# EasyEDA schematic Bravo-M2-ALU-Registers.json

## Sheets
1 Bravo-M2-ALU: TITLE: Bravo V1.0-M2-ALU; REV: 1.0; Date: 2021-11-21; Sheet: 1/4; Drawn By: Kaveh Majidi (CONFIG IOI)
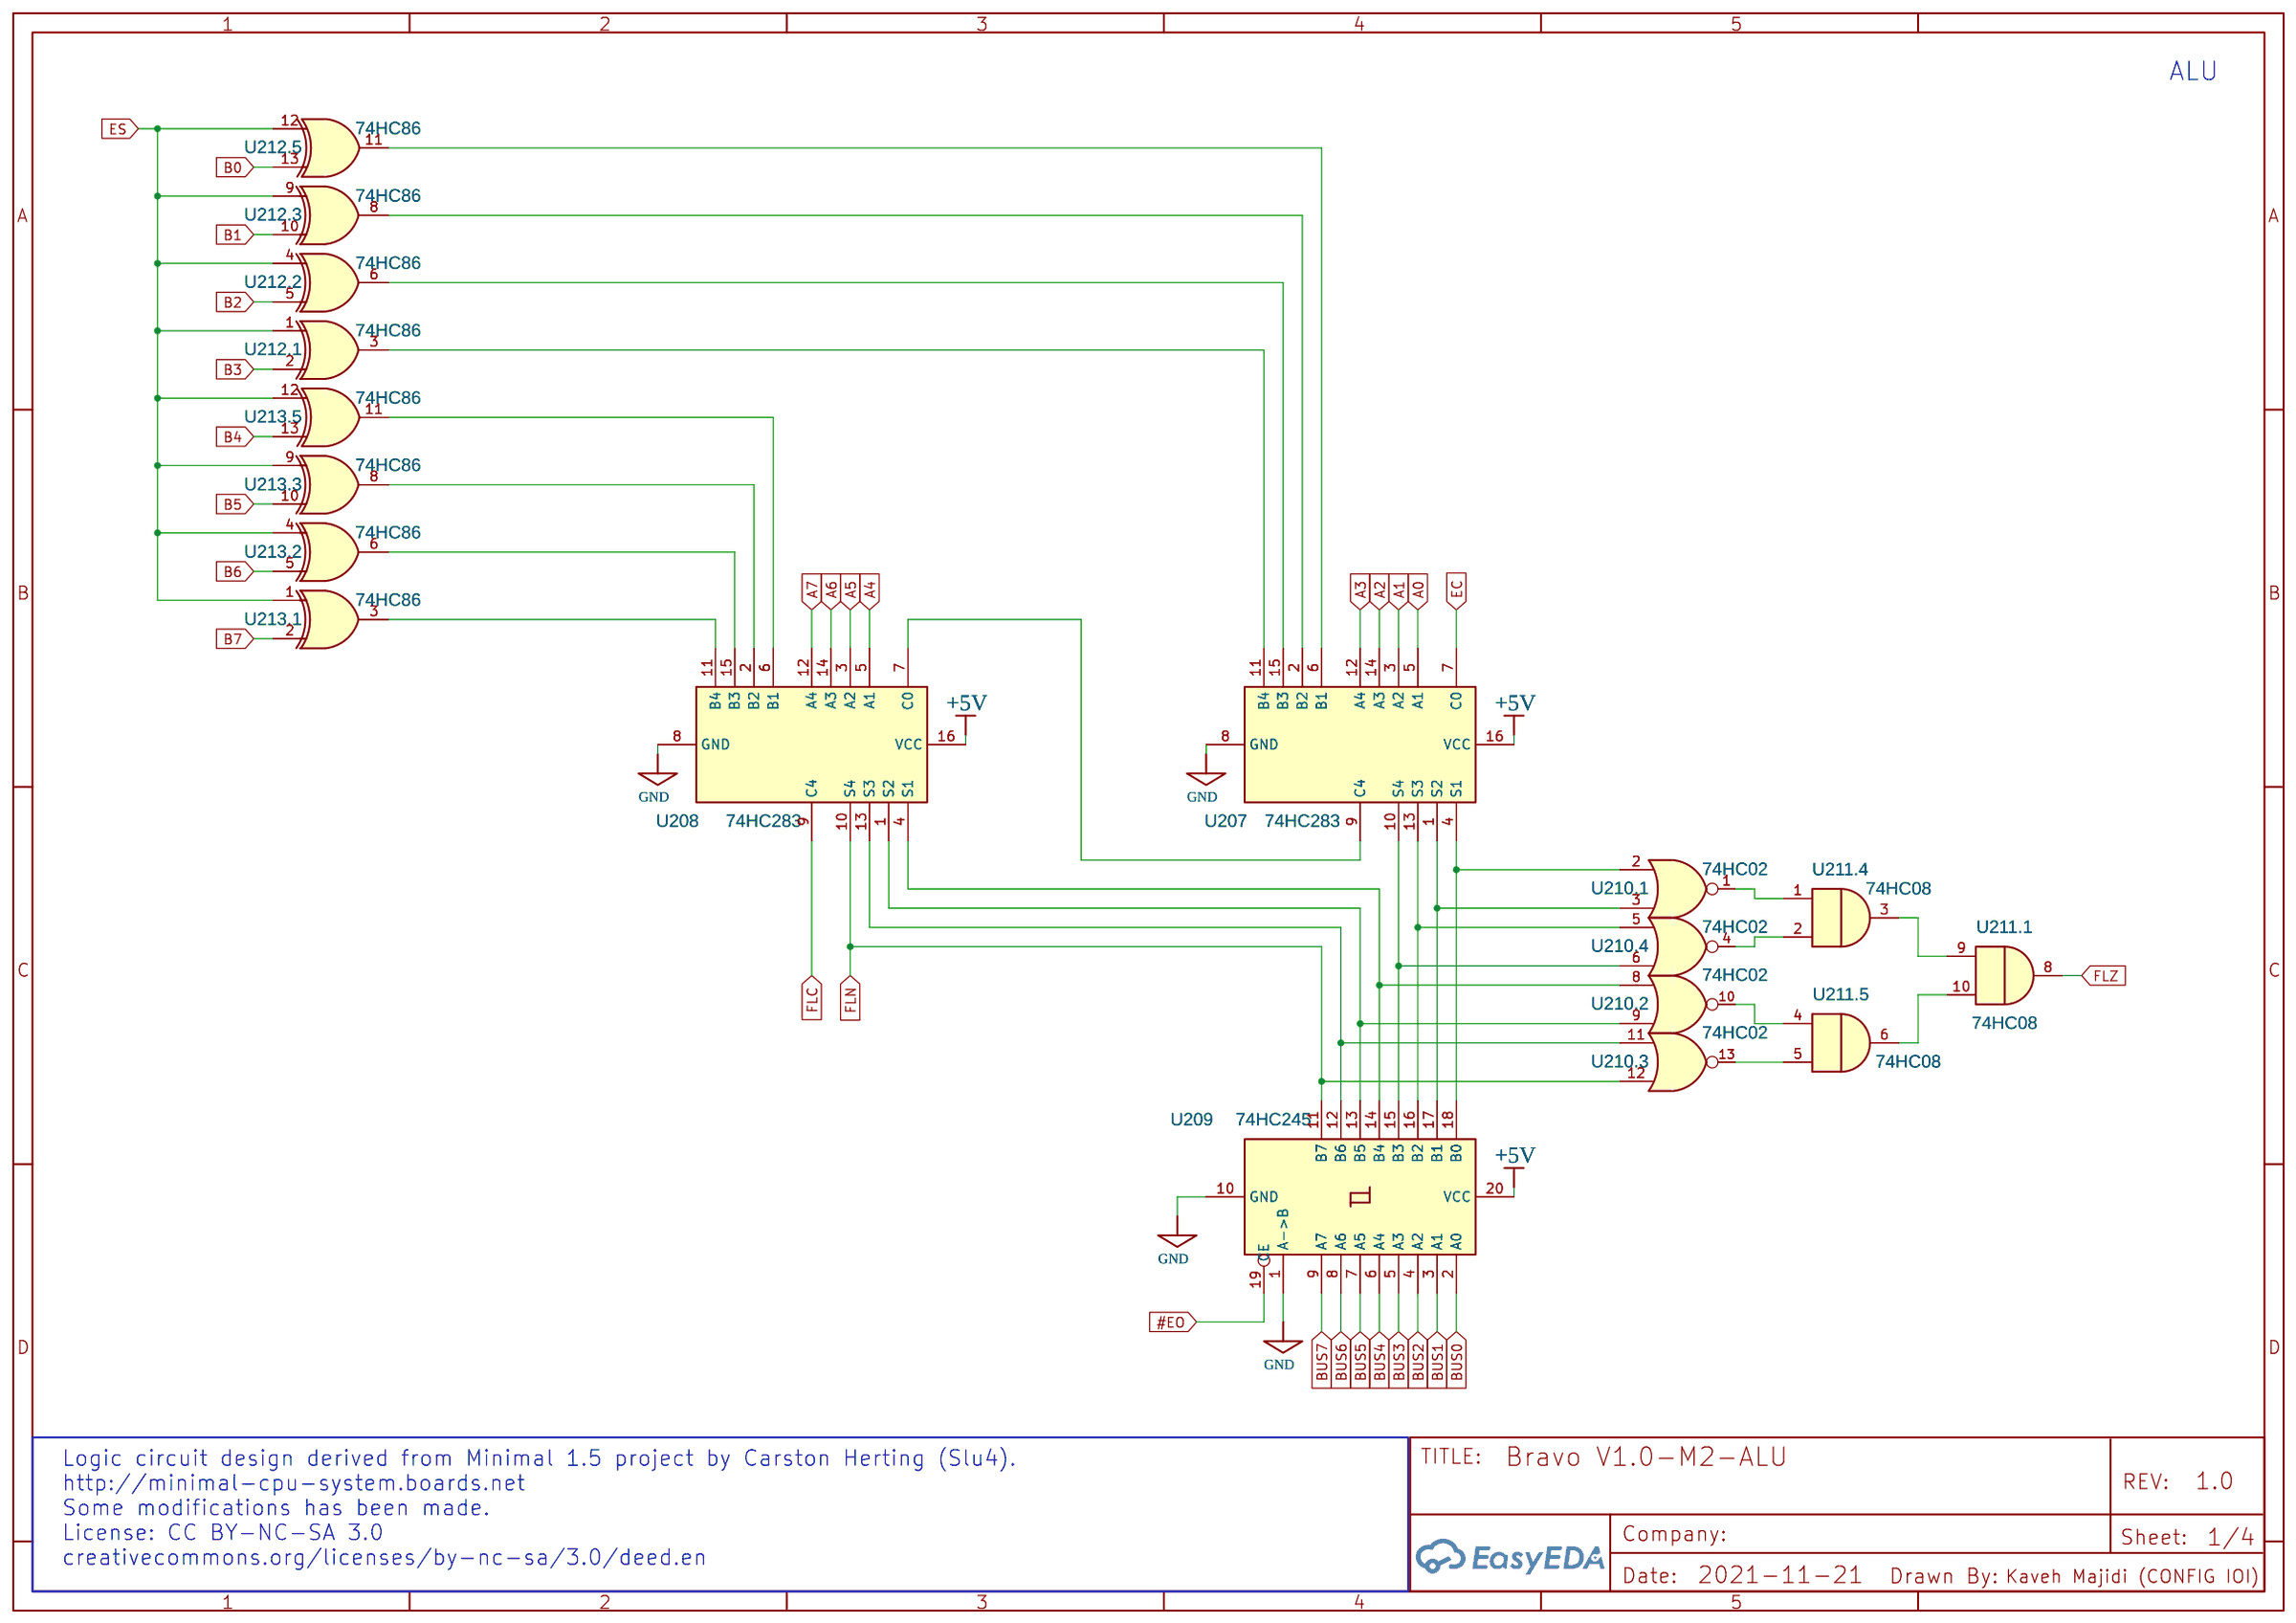
[diagram p0: Bravo-M2-ALU]
2 Bravo-M2-A Register: Sheet: 2/4
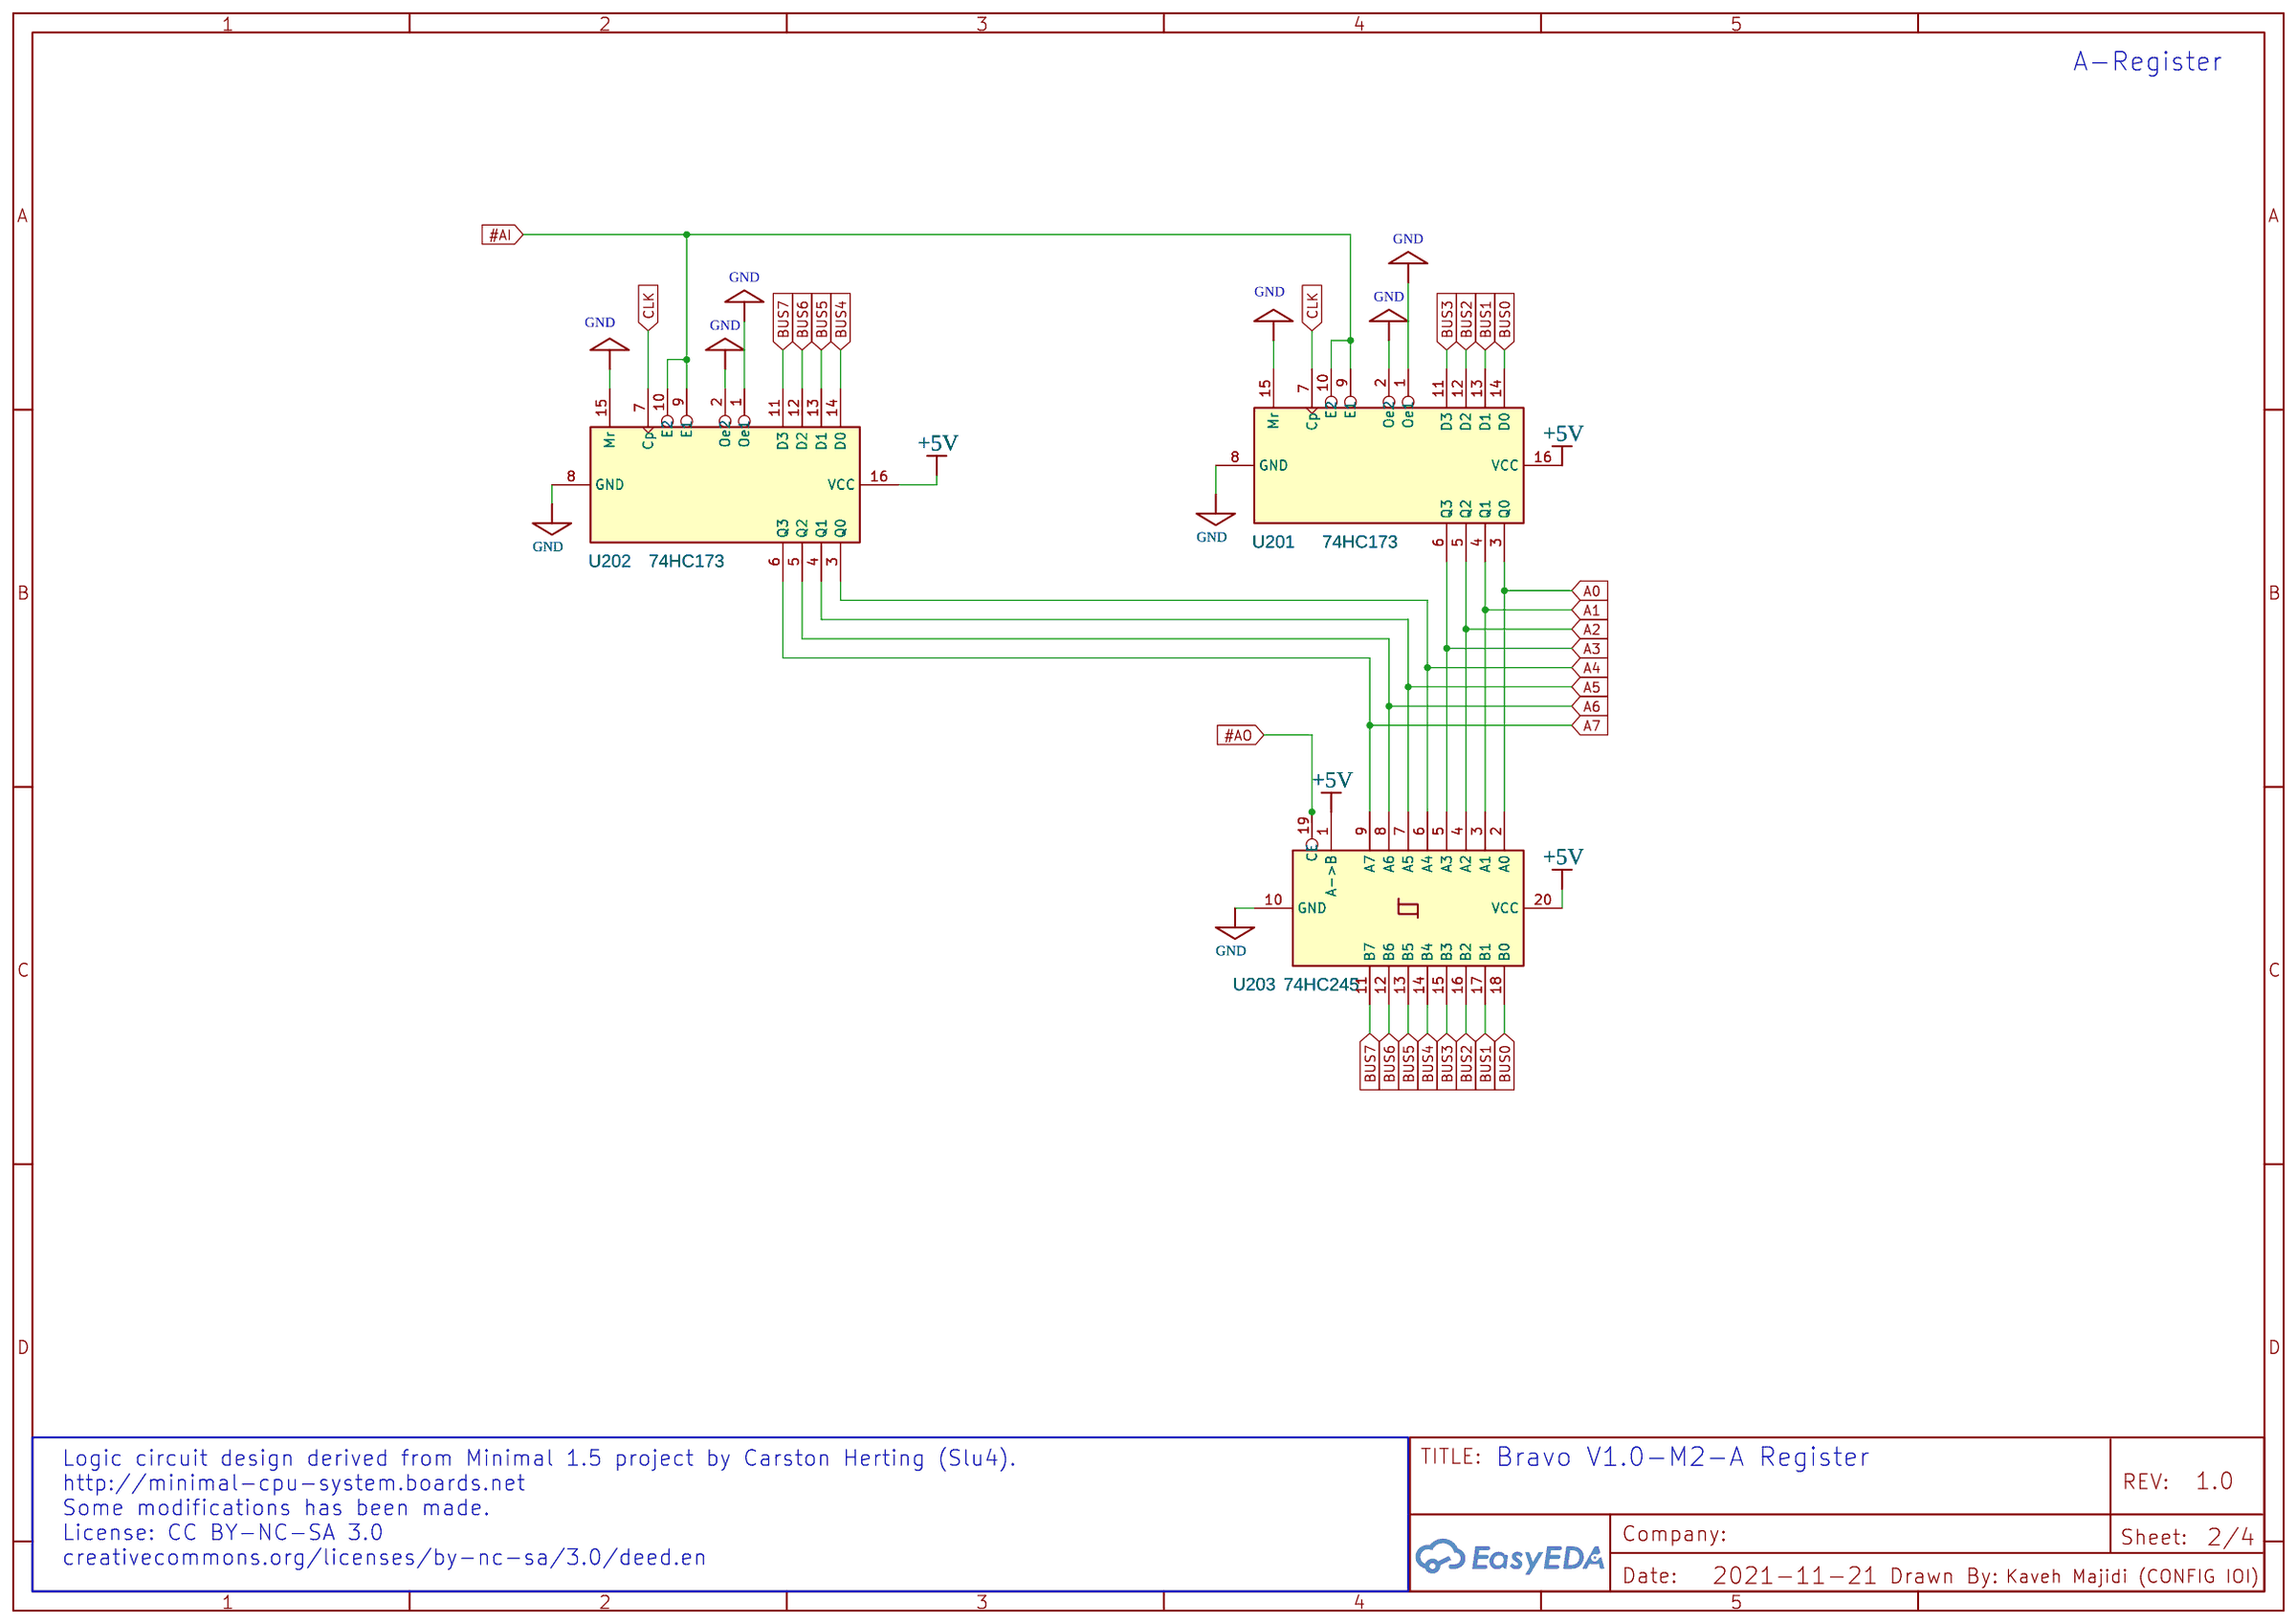
[diagram p1: Bravo-M2-A Register]
3 Bravo-M2-B Register: TITLE: Bravo V1.0-M2-B Register; Sheet: 3/4
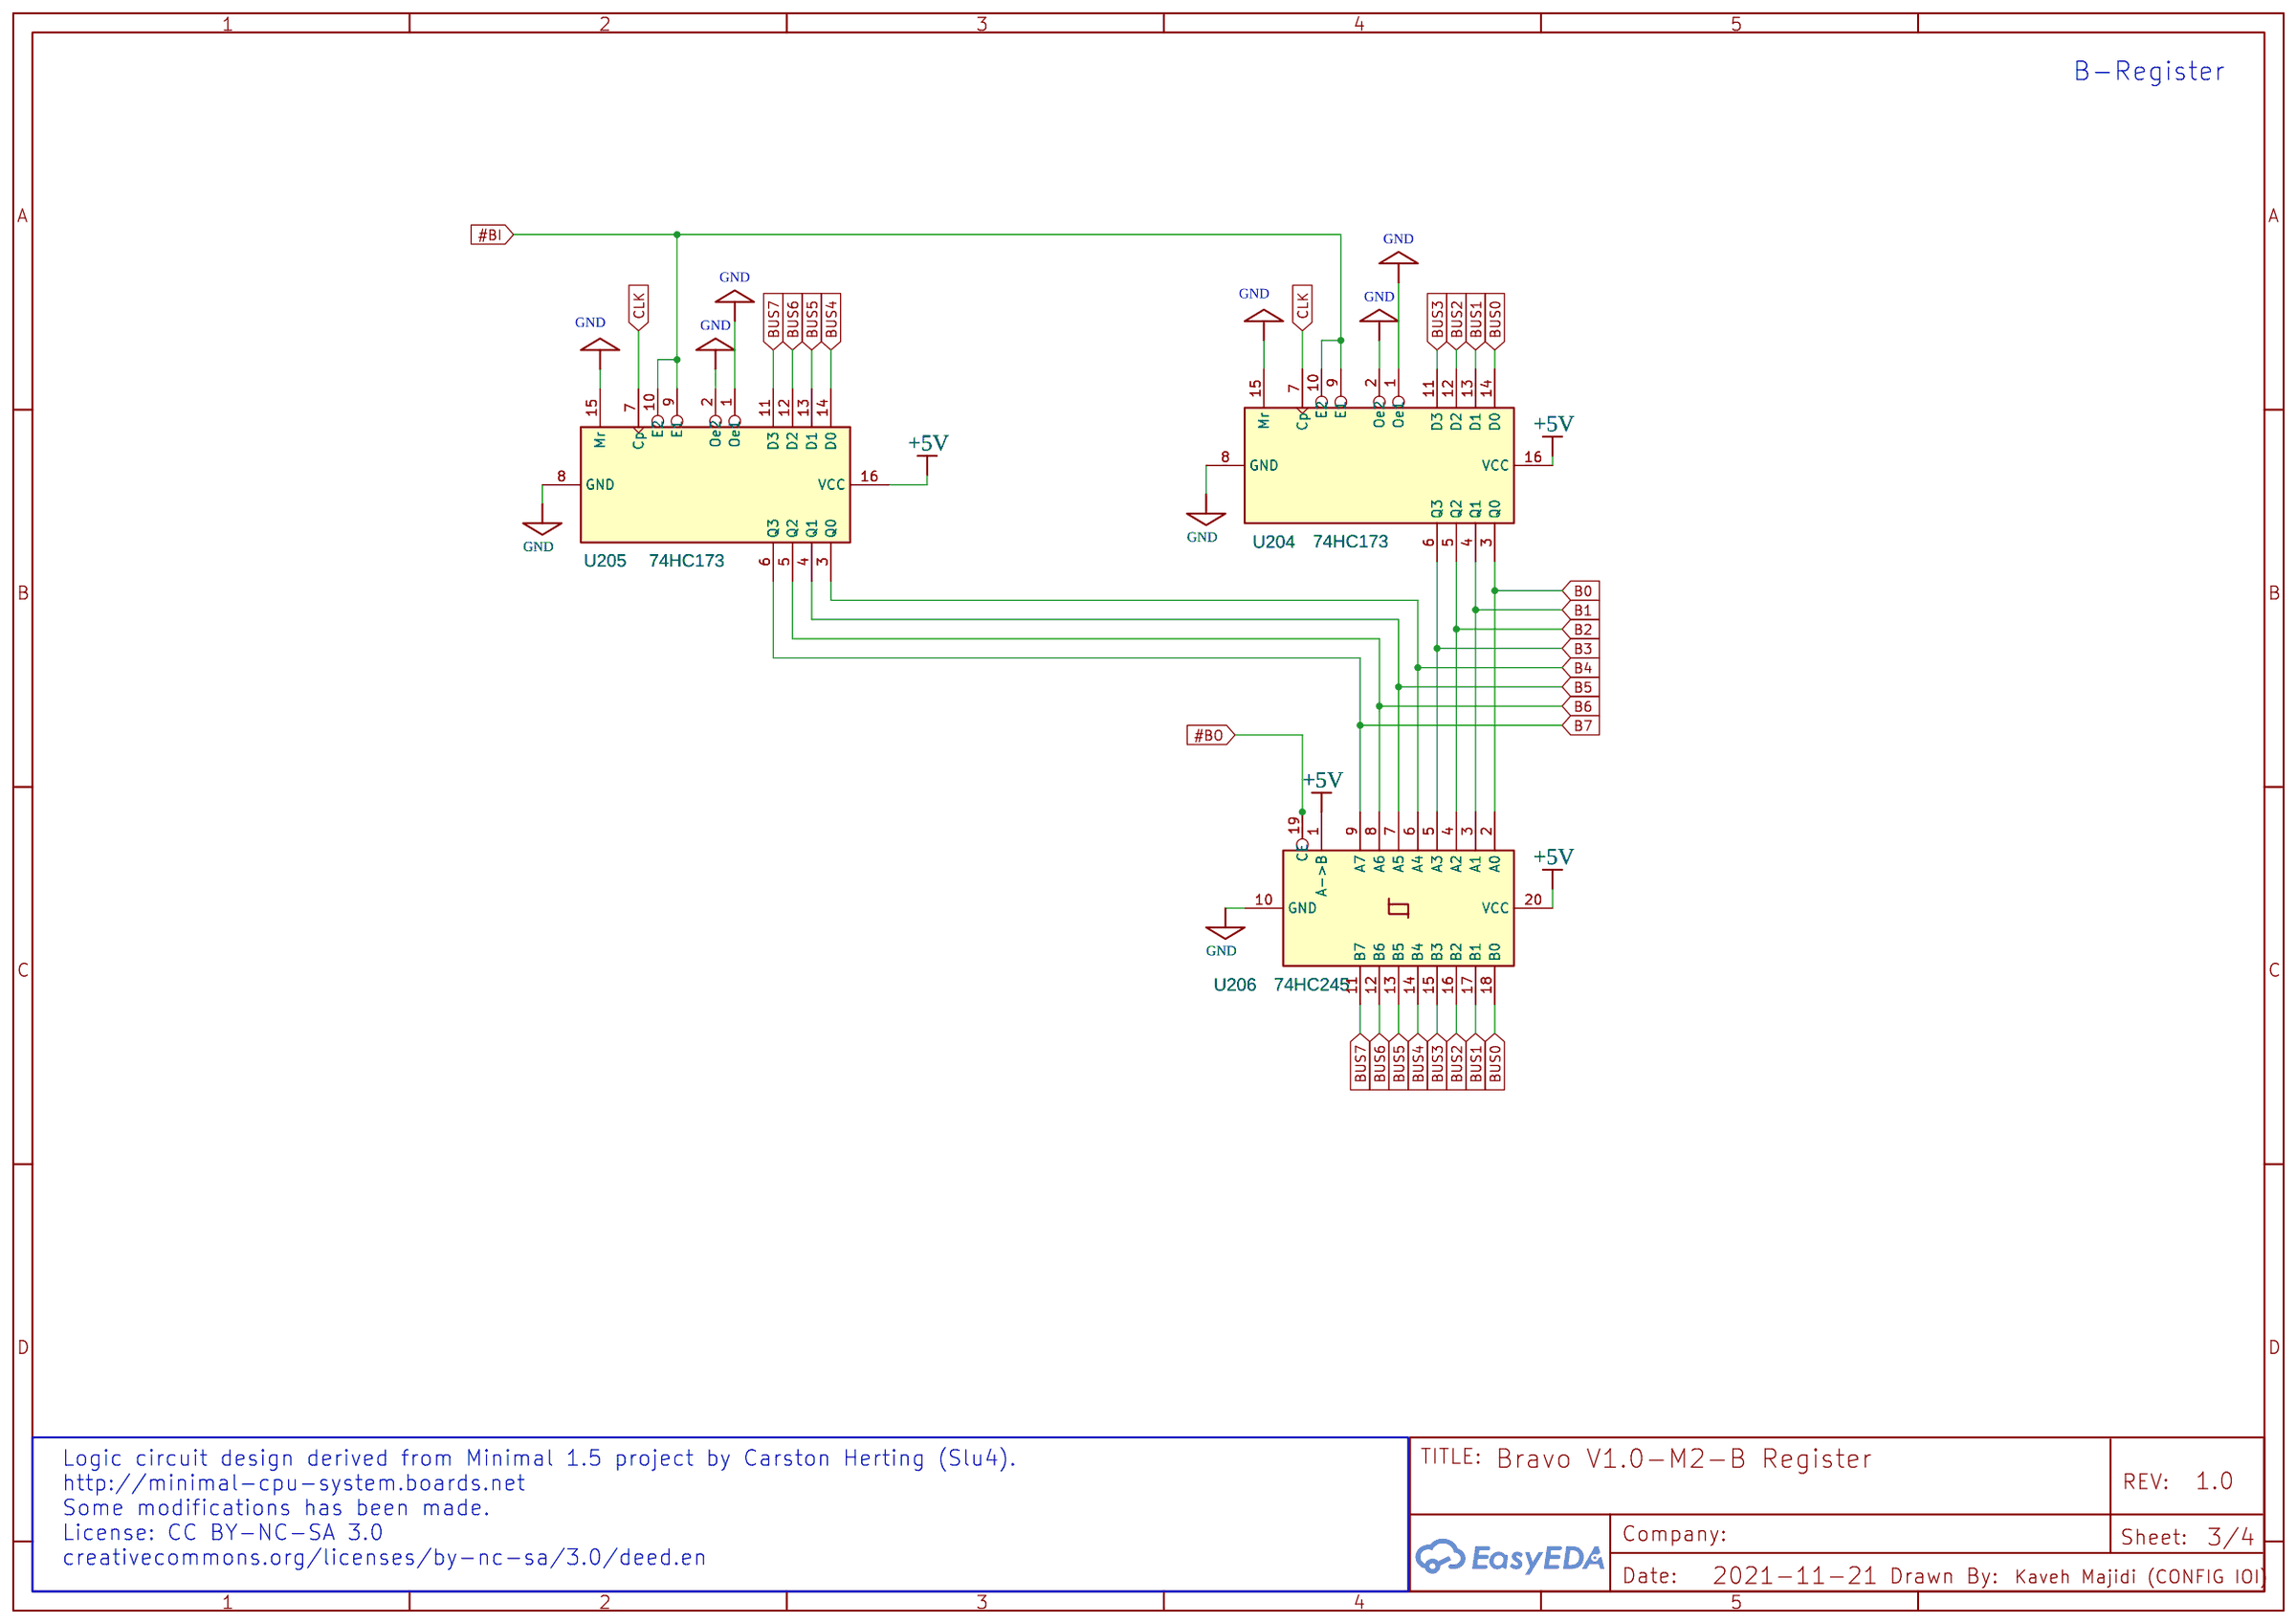
[diagram p2: Bravo-M2-B Register]
4 Bravo-M2-Common: TITLE: Bravo V1.0-M2-Common; Sheet: 4/4
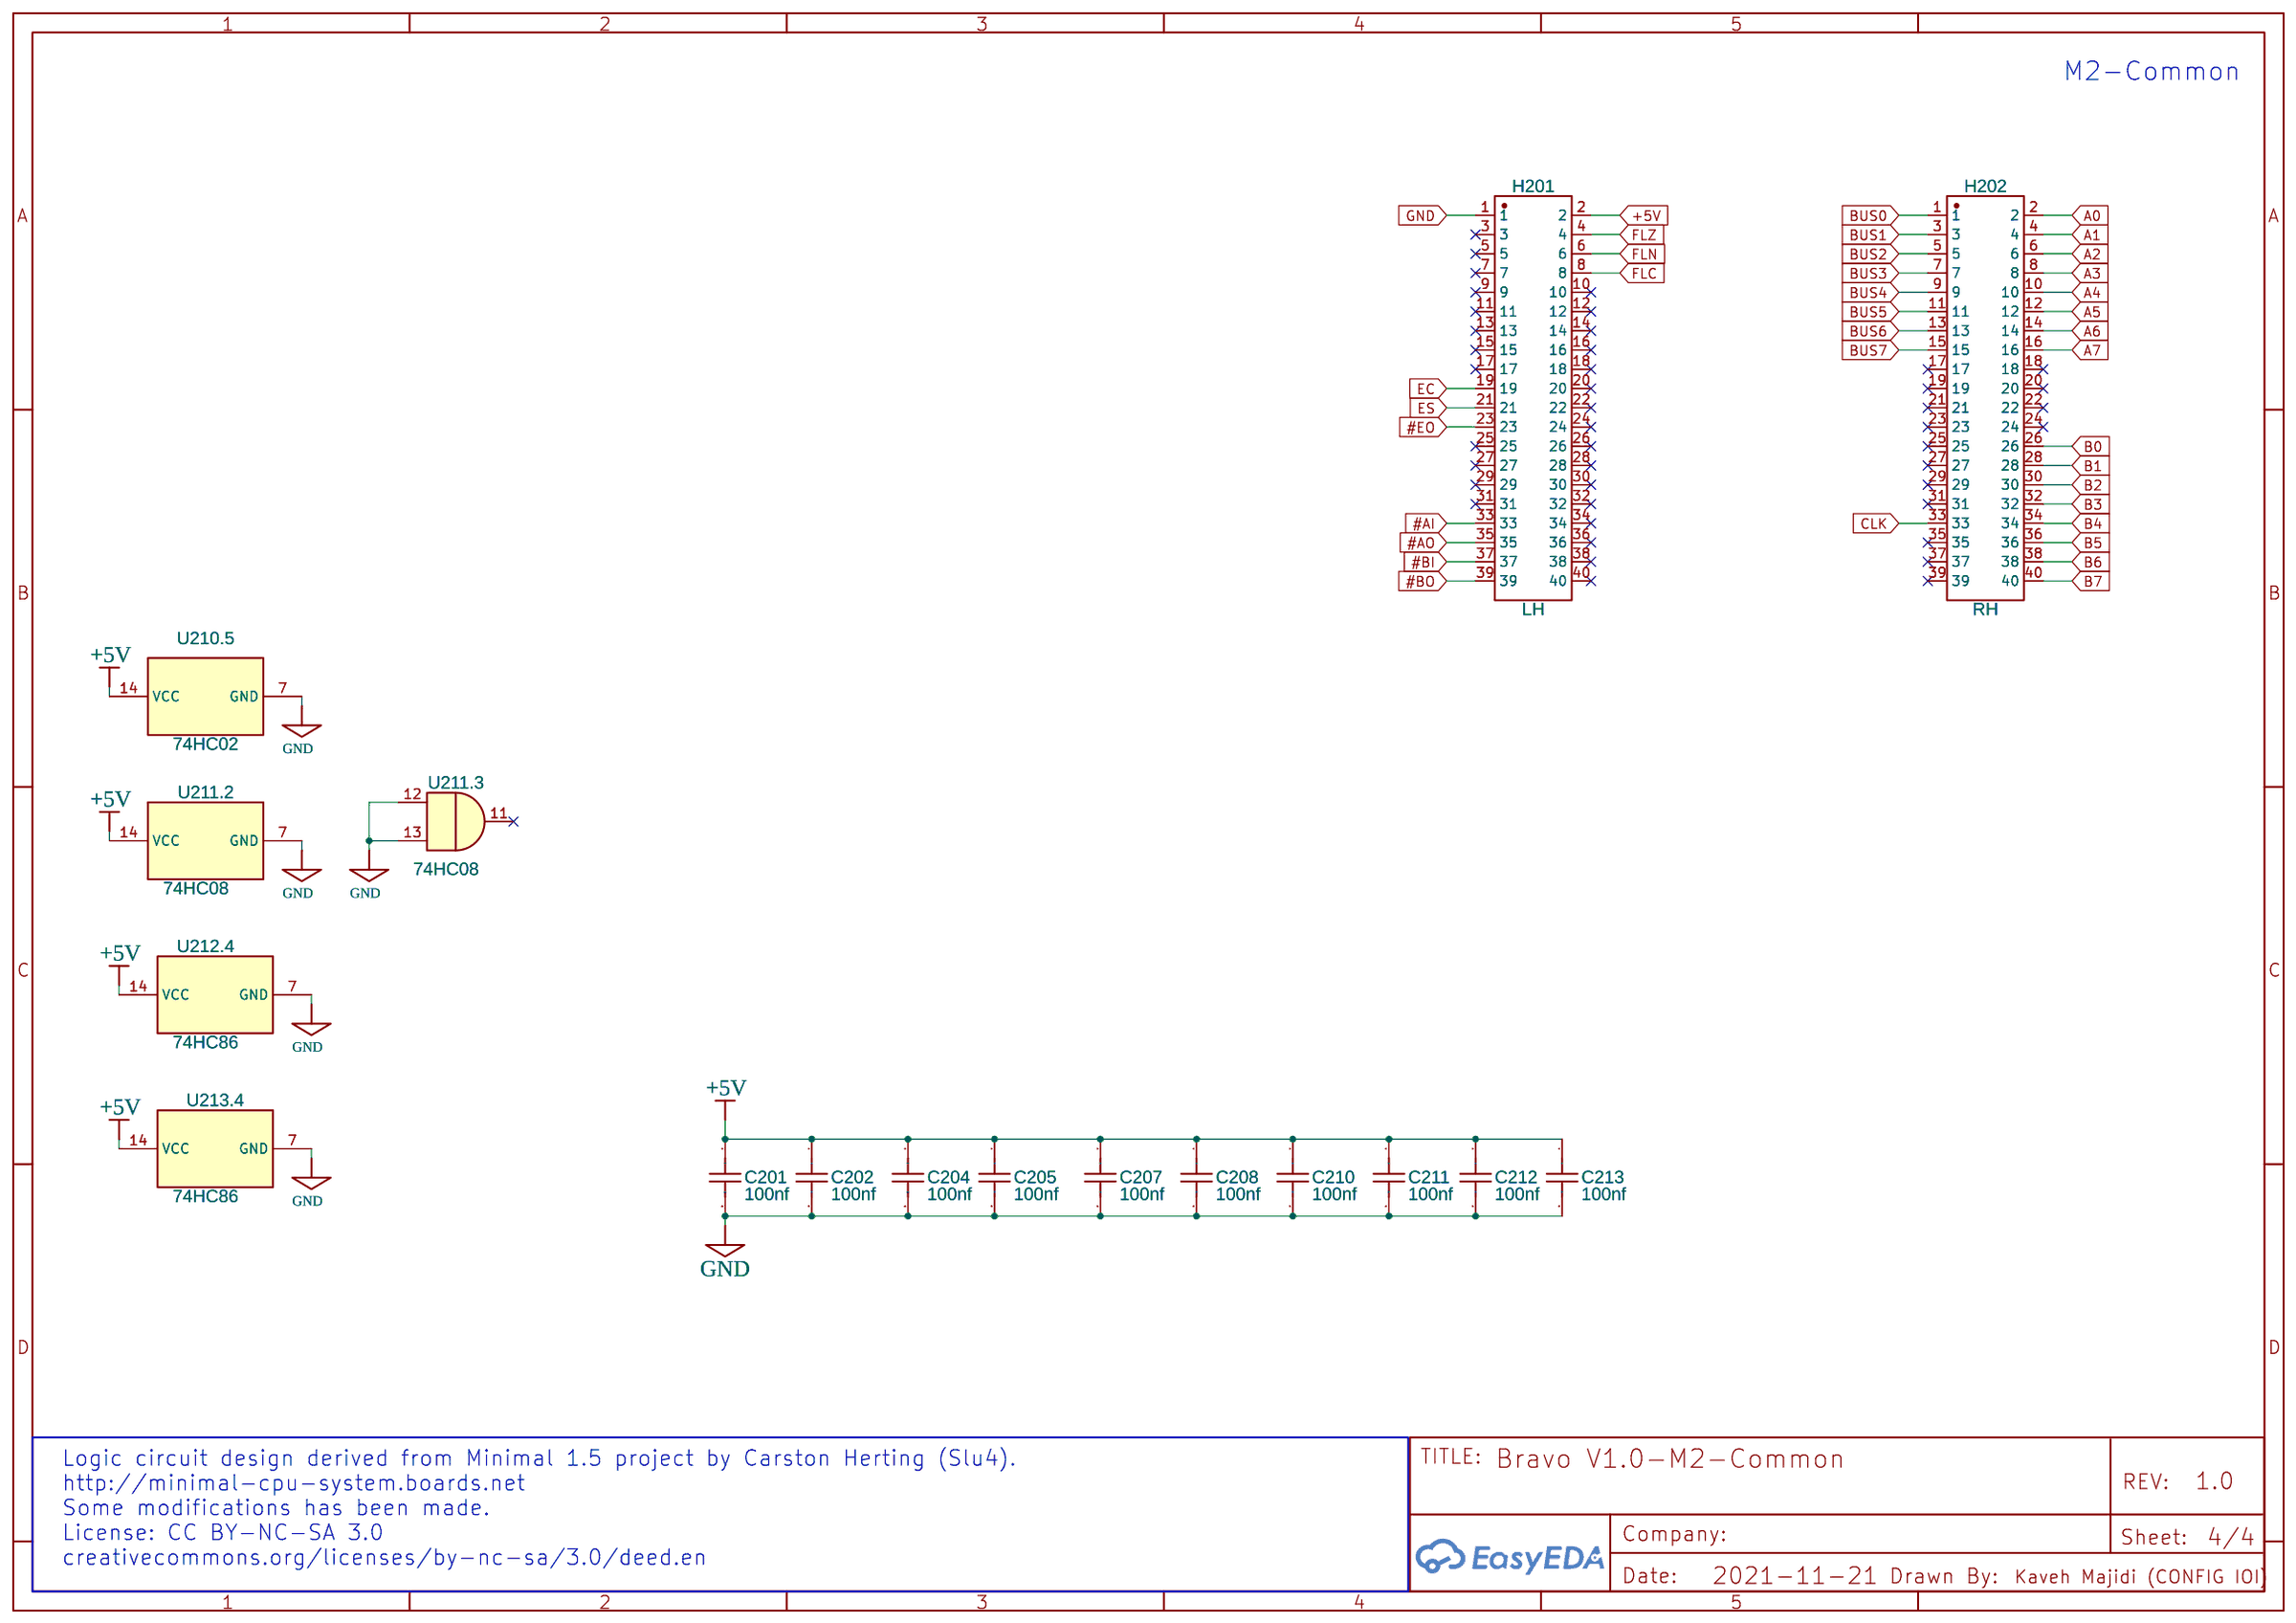
[diagram p3: Bravo-M2-Common]

## Parts
sheet Bravo-M2-A Register
U201  74HC173  [DIP-16_W7.62MM_SOCKET]
U202  74HC173  [DIP-16_W7.62MM_SOCKET]
U203  74HC245  [DIP-20-2.54MM]
sheet Bravo-M2-ALU
U207  74HC283  [DIP-16_W7.62MM_SOCKET]
U208  74HC283  [DIP-16_W7.62MM_SOCKET]
U209  74HC245  [DIP-20-2.54MM]
U210  74HC02  [DIP-14_W7.62MM_SOCKET]  (sections 1,2,3,4,5)
U211  74HC08  [DIP-14_W7.62MM_SOCKET]  (sections 1,2,3,4,5)
U212  74HC86  [DIP-14_W7.62MM_SOCKET]  (sections 1,2,3,4,5)
U213  74HC86  [DIP-14_W7.62MM_SOCKET]  (sections 1,2,3,4,5)
sheet Bravo-M2-B Register
U204  74HC173  [DIP-16_W7.62MM_SOCKET]
U205  74HC173  [DIP-16_W7.62MM_SOCKET]
U206  74HC245  [DIP-20-2.54MM]
sheet Bravo-M2-Common
C201  100nf  [CAP-TH_L4.0-W2.5-P5.00-D1.0]
C202  100nf  [CAP-TH_L4.0-W2.5-P5.00-D1.0]
C204  100nf  [CAP-TH_L4.0-W2.5-P5.00-D1.0]
C205  100nf  [CAP-TH_L4.0-W2.5-P5.00-D1.0]
C207  100nf  [CAP-TH_L4.0-W2.5-P5.00-D1.0]
C208  100nf  [CAP-TH_L4.0-W2.5-P5.00-D1.0]
C210  100nf  [CAP-TH_L4.0-W2.5-P5.00-D1.0]
C211  100nf  [CAP-TH_L4.0-W2.5-P5.00-D1.0]
C212  100nf  [CAP-TH_L4.0-W2.5-P5.00-D1.0]
C213  100nf  [CAP-TH_L4.0-W2.5-P5.00-D1.0]
H201  LH  [HEADER-2X20-2.54]
H202  RH  [HEADER-2X20-2.54]

## Library data of the parts
U201 U202 U204 U205 = 8-Bit_CPU_32k_74HC173: Contributor: SegfaultCoder
U203 U206 = 74HC245: Contributor: ardugeek
U207 U208 = 74HC283: Contributor: SegfaultCoder
U209 = 74HC245: Contributor: Andrew Fox
U210 = 74HC02: Contributor: DSOP13; subpart_no: 1
U211 = 74HC08: Quad 2-Input AND Gates; subpart_no: 1
U212 U213 = 74HC86: Contributor: WolfHenk; subpart_no: 1
C201 C202 C204 C205 C207 C208 C210-C213 = CC45SL3AD220JYVNA: Supplier: LCSC; Supplier Part: C342429; Manufacturer: TDK; Contributor: LCSC
H201 H202 = HEADER-2x20-2.54: Manufacturer Part: Headers  Pins2.54mm1*10P; image: http://image.lceda.cn/szlcsc/C57369.jpg; Supplier Part: C57369; Contributor: panasonic-spunt

## Nets
+5V: C201.1 C202.1 C204.1 C205.1 C207.1 C208.1 C210.1 C211.1 C212.1 C213.1 H201.2 U201.16(VCC) U202.16(VCC) U203.1(A->B) U203.20(VCC) U204.16(VCC) U205.16(VCC) U206.1(A->B) U206.20(VCC) U207.16(VCC) U208.16(VCC) U209.20(VCC) U210.14(VCC) U211.14(VCC) U212.14(VCC) U213.14(VCC)
GND: C201.2 C202.2 C204.2 C205.2 C207.2 C208.2 C210.2 C211.2 C212.2 C213.2 H201.1 U201.1(Oe1) U201.2(Oe2) U201.8(GND) U201.15(Mr) U202.1(Oe1) U202.2(Oe2) U202.8(GND) U202.15(Mr) U203.10(GND) U204.1(Oe1) U204.2(Oe2) U204.8(GND) U204.15(Mr) U205.1(Oe1) U205.2(Oe2) U205.8(GND) U205.15(Mr) U206.10(GND) U207.8(GND) U208.8(GND) U209.1(A->B) U209.10(GND) U210.7(GND) U211.7(GND) U211.12 U211.13 U212.7(GND) U213.7(GND)
#AI: H201.33 U201.9(E1) U201.10(E2) U202.9(E1) U202.10(E2)
#AO: H201.35 U203.19(CE)
#BI: H201.37 U204.9(E1) U204.10(E2) U205.9(E1) U205.10(E2)
#BO: H201.39 U206.19(CE)
#EO: H201.23 U209.19(CE)
A0: H202.2 U201.3(Q0) U203.2(A0) U207.5(A1)
A1: H202.4 U201.4(Q1) U203.3(A1) U207.3(A2)
A2: H202.6 U201.5(Q2) U203.4(A2) U207.14(A3)
A3: H202.8 U201.6(Q3) U203.5(A3) U207.12(A4)
A4: H202.10 U202.3(Q0) U203.6(A4) U208.5(A1)
A5: H202.12 U202.4(Q1) U203.7(A5) U208.3(A2)
A6: H202.14 U202.5(Q2) U203.8(A6) U208.14(A3)
A7: H202.16 U202.6(Q3) U203.9(A7) U208.12(A4)
B0: H202.26 U204.3(Q0) U206.2(A0) U212.13
B1: H202.28 U204.4(Q1) U206.3(A1) U212.10
B2: H202.30 U204.5(Q2) U206.4(A2) U212.5
B3: H202.32 U204.6(Q3) U206.5(A3) U212.2
B4: H202.34 U205.3(Q0) U206.6(A4) U213.13
B5: H202.36 U205.4(Q1) U206.7(A5) U213.10
B6: H202.38 U205.5(Q2) U206.8(A6) U213.5
B7: H202.40 U205.6(Q3) U206.9(A7) U213.2
BUS0: H202.1 U201.14(D0) U203.18(B0) U204.14(D0) U206.18(B0) U209.2(A0)
BUS1: H202.3 U201.13(D1) U203.17(B1) U204.13(D1) U206.17(B1) U209.3(A1)
BUS2: H202.5 U201.12(D2) U203.16(B2) U204.12(D2) U206.16(B2) U209.4(A2)
BUS3: H202.7 U201.11(D3) U203.15(B3) U204.11(D3) U206.15(B3) U209.5(A3)
BUS4: H202.9 U202.14(D0) U203.14(B4) U205.14(D0) U206.14(B4) U209.6(A4)
BUS5: H202.11 U202.13(D1) U203.13(B5) U205.13(D1) U206.13(B5) U209.7(A5)
BUS6: H202.13 U202.12(D2) U203.12(B6) U205.12(D2) U206.12(B6) U209.8(A6)
BUS7: H202.15 U202.11(D3) U203.11(B7) U205.11(D3) U206.11(B7) U209.9(A7)
CLK: H202.33 U201.7(Cp) U202.7(Cp) U204.7(Cp) U205.7(Cp)
EC: H201.19 U207.7(C0)
ES: H201.21 U212.1 U212.4 U212.9 U212.12 U213.1 U213.4 U213.9 U213.12
FLC: H201.8 U208.9(C4)
FLN: H201.6 U208.10(S4) U209.11(B7) U210.12
FLZ: H201.4 U211.8
Net-(U207-1): U207.1(S2) U209.17(B1) U210.3
Net-(U207-2): U207.2(B2) U212.8
Net-(U207-4): U207.4(S1) U209.18(B0) U210.2
Net-(U207-6): U207.6(B1) U212.11
Net-(U207-9): U207.9(C4) U208.7(C0)
Net-(U207-10): U207.10(S4) U209.15(B3) U210.6
Net-(U207-11): U207.11(B4) U212.3
Net-(U207-13): U207.13(S3) U209.16(B2) U210.5
Net-(U207-15): U207.15(B3) U212.6
Net-(U208-1): U208.1(S2) U209.13(B5) U210.9
Net-(U208-2): U208.2(B2) U213.8
Net-(U208-4): U208.4(S1) U209.14(B4) U210.8
Net-(U208-6): U208.6(B1) U213.11
Net-(U208-11): U208.11(B4) U213.3
Net-(U208-13): U208.13(S3) U209.12(B6) U210.11
Net-(U208-15): U208.15(B3) U213.6
Net-(U210.1-1): U210.1 U211.1
Net-(U210.2-10): U210.10 U211.4
Net-(U210.3-13): U210.13 U211.5
Net-(U210.4-4): U210.4 U211.2
Net-(U211.1-9): U211.3 U211.9
Net-(U211.1-10): U211.6 U211.10

Not connected (* = marked no-connect by the designer): H201 3* 5* 7* 9* 10* 11* 12* 13* 14* 15* 16* 17* 18* 20* 22* 24* 25* 26* 27* 28* 29* 30* 31* 32* 34* 36* 38* 40*; H202 17* 18* 19* 20* 21* 22* 23* 24* 25* 27* 29* 31* 35* 37* 39*; U211 11*

## Notes on the sheets
sheet 1
- ALU
- Logic circuit design derived from Minimal 1.5 project by Carston Herting (Slu4).
  http://minimal-cpu-system.boards.net
  Some modifications has been made.
  License: CC BY-NC-SA 3.0
  creativecommons.org/licenses/by-nc-sa/3.0/deed.en
sheet 2
- A-Register
- Logic circuit design derived from Minimal 1.5 project by Carston Herting (Slu4).
  http://minimal-cpu-system.boards.net
  Some modifications has been made.
  License: CC BY-NC-SA 3.0
  creativecommons.org/licenses/by-nc-sa/3.0/deed.en
- Bravo V1.0-M2-A Register
sheet 3
- B-Register
- Logic circuit design derived from Minimal 1.5 project by Carston Herting (Slu4).
  http://minimal-cpu-system.boards.net
  Some modifications has been made.
  License: CC BY-NC-SA 3.0
  creativecommons.org/licenses/by-nc-sa/3.0/deed.en
sheet 4
- M2-Common
- Logic circuit design derived from Minimal 1.5 project by Carston Herting (Slu4).
  http://minimal-cpu-system.boards.net
  Some modifications has been made.
  License: CC BY-NC-SA 3.0
  creativecommons.org/licenses/by-nc-sa/3.0/deed.en
